# Altium schematic sheet MUX8.SchDoc
size A4; DocumentNumber: 5; SheetNumber: 5; SheetTotal: 8
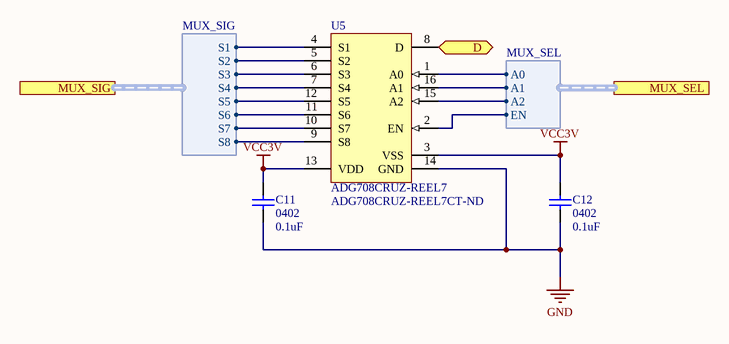
[diagram p0: MUX8.SchDoc]

## Parts
C11  0402  value 0.1uF  [RAD-0.3]
C12  0402  value 0.1uF  [RAD-0.3]
U5  ADG708CRUZ-REEL7  Supplier Part Number 1: ADG708CRUZ-REEL7CT-ND  [ADI-RU-16_M]

## Ports
D (bidir), MUX_SEL (harness MUX_SEL), MUX_SIG (harness MUX_SIG)

## Harnesses
MUX_SIG: S1, S2, S3, S4, S5, S6, S7, S8
MUX_SEL: A0, A1, A2, EN

## Nets
GND: C11.1 C12.1 U5.14(GND)
VCC3V: C11.2 C12.2 U5.3(VSS) U5.13(VDD)
D: U5.8(D) ; port D
NetU5_1: U5.1(A0) ; port MUX_SEL.A0
NetU5_2: U5.2(EN) ; port MUX_SEL.EN
NetU5_4: U5.4(S1) ; port MUX_SIG.S1
NetU5_5: U5.5(S2) ; port MUX_SIG.S2
NetU5_6: U5.6(S3) ; port MUX_SIG.S3
NetU5_7: U5.7(S4) ; port MUX_SIG.S4
NetU5_9: U5.9(S8) ; port MUX_SIG.S8
NetU5_10: U5.10(S7) ; port MUX_SIG.S7
NetU5_11: U5.11(S6) ; port MUX_SIG.S6
NetU5_12: U5.12(S5) ; port MUX_SIG.S5
NetU5_15: U5.15(A2) ; port MUX_SEL.A2
NetU5_16: U5.16(A1) ; port MUX_SEL.A1

## Library data of the parts
C11 C12 = Cap: Capacitor; Published: 8-Jun-2000; LatestRevisionDate: 17-Jul-2002; LatestRevisionNote: Re-released for DXP Platform.; PackageReference: RAD-0.3; Publisher: Altium Limited; PackageDescription: Radial Cap, Thru-Hole; 2 Leads; 0.3 in Pin Spacing
U5 = ADG708CRUZ-REEL7: 1.8 to 5.5 V / +/-2.5 V, CMOS Low Voltage 3 Ohm, 8-Channel Multiplexer, -40 to 125 degC, 16-pin SOP (RU-16), Reel; Manufacturer: Analog Devices; Supply V Guar Performance: Dual_(+/-2.5V), Single_(+3V), Single_(+5V); t transition (s): 14n; Bandwidth (Hz): 55M; Max Analog Signal Range: Vss to Vdd; Ron (ohms): 3; PackageVersion: Nov-02; ComponentLink1Description: Manufacturer URL; ComponentLink2Description: Datasheet; ComponentLink3Description: Package Specification; Mounting Technology: Surface Mount; ComponentLink3URL: http:/www.analog.com/static/imported-files/packages/36244347913743854010197452789RU16.pdf; DatasheetVersion: Rev. C; ComponentLink1URL: http://www.analog.com/en/index.html; Code_JEDEC: MO-153AB; Packing: Reel; PartNumber: ADG708CRUZ-REEL7; PackageReference: RU-16; PackageDescription: 16-Pin Thin Shrink Small Outline Package, Body 5 x 4.4 mm, Pitch 0.65 mm; ComponentLink2URL: http://www.analog.com/static/imported-files/data_sheets/ADG708_709.pdf; Supplier 1: Digi-Key